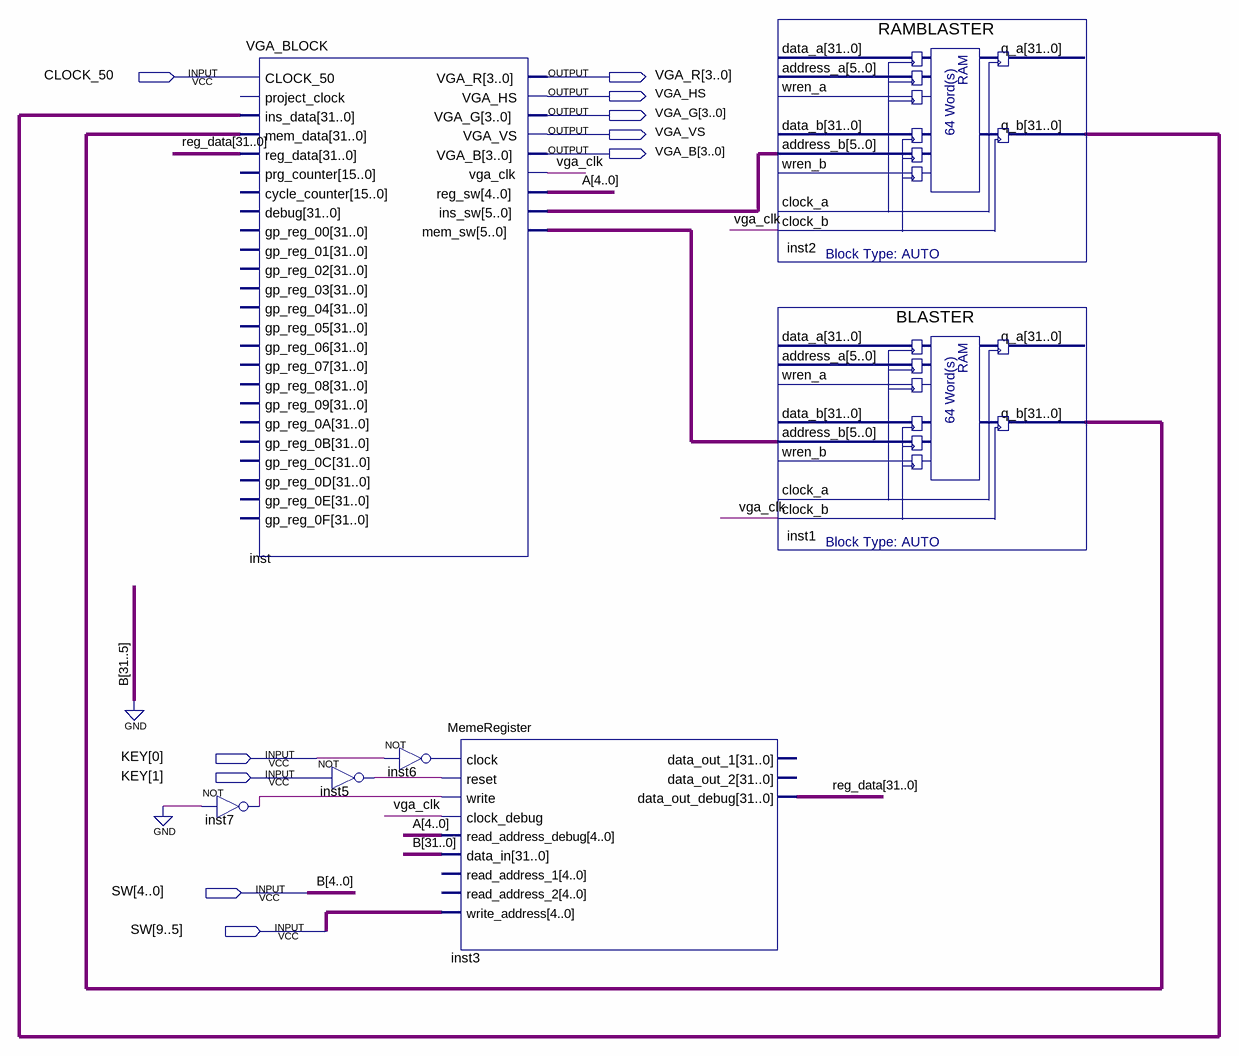
[diagram p0: schematic sheet]
// Quartus schematic BADLAB.bdf as structural Verilog: 7 symbols, 10 pins
module BADLAB (
  input  CLOCK_50,
  input  [1:0] KEY,
  input  [9:0] SW,
  output [3:0] VGA_R,
  output VGA_HS,
  output [3:0] VGA_G,
  output VGA_VS,
  output [3:0] VGA_B
);

  wire inst5_out, inst6_out, inst7_out, vga_clk;
  wire [4:0] A;
  wire [5:0] inst_ins_sw, inst_mem_sw;
  wire [31:0] inst1_q_b, inst2_q_b, reg_data;

  not inst7 (inst7_out, 1'b0);
  VGA_BLOCK inst (
    .CLOCK_50(CLOCK_50), .ins_data(inst2_q_b), .mem_data(inst1_q_b), .reg_data(reg_data), .VGA_R(VGA_R),
    .VGA_HS(VGA_HS), .VGA_G(VGA_G), .VGA_VS(VGA_VS), .VGA_B(VGA_B), .vga_clk(vga_clk), .reg_sw(A),
    .ins_sw(inst_ins_sw), .mem_sw(inst_mem_sw));  // open: project_clock, prg_counter, cycle_counter, debug, gp_reg_00, gp_reg_01, gp_reg_02, gp_reg_03, gp_reg_04, gp_reg_05, gp_reg_06, gp_reg_07, gp_reg_08, gp_reg_09, gp_reg_0A, gp_reg_0B, gp_reg_0C, gp_reg_0D, gp_reg_0E, gp_reg_0F
  not inst6 (inst6_out, KEY[0]);
  not inst5 (inst5_out, KEY[1]);
  MemeRegister inst3 (
    .clock(inst6_out), .reset(inst5_out), .write(inst7_out), .clock_debug(vga_clk), .read_address_debug(A),
    .data_in({{27{1'b0}}, SW[4:0]}), .write_address(SW[9:5]), .data_out_debug(reg_data));  // open: read_address_1, read_address_2, data_out_1, data_out_2
  RAMBLASTER inst2 (
    .address_b(inst_ins_sw), .clock_b(vga_clk), .q_b(inst2_q_b));  // open: data_a, address_a, wren_a, data_b, wren_b, clock_a, q_a
  BLASTER inst1 (
    .address_b(inst_mem_sw), .clock_b(vga_clk), .q_b(inst1_q_b));  // open: data_a, address_a, wren_a, data_b, wren_b, clock_a, q_a

  // Other names for the same wires on the sheet: B[4:0] = SW[4:0]
endmodule
